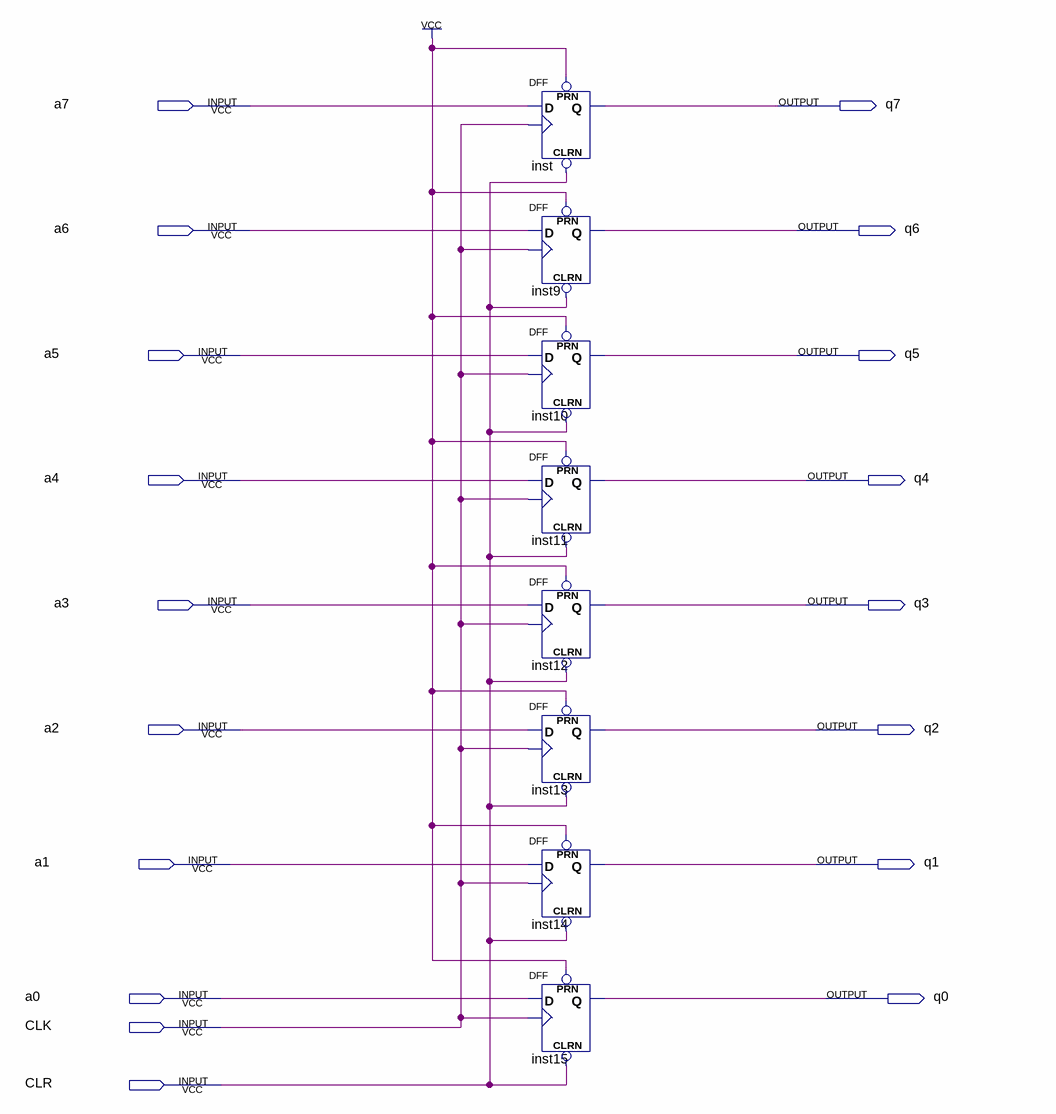
[diagram p0: schematic sheet]
// Quartus schematic REGrs.bdf as structural Verilog: 8 symbols, 18 pins
module REGrs (
  input  a7,
  input  a6,
  input  a5,
  input  a4,
  input  a3,
  input  a2,
  input  a1,
  input  a0,
  input  CLK,
  input  CLR,
  output q7,
  output q6,
  output q5,
  output q4,
  output q3,
  output q2,
  output q1,
  output q0
);

  DFF inst (.CLRN(CLR), .CLK(CLK), .D(a7), .PRN(1'b1), .Q(q7));
  DFF inst9 (.CLRN(CLR), .CLK(CLK), .D(a6), .PRN(1'b1), .Q(q6));
  DFF inst10 (.CLRN(CLR), .CLK(CLK), .D(a5), .PRN(1'b1), .Q(q5));
  DFF inst11 (.CLRN(CLR), .CLK(CLK), .D(a4), .PRN(1'b1), .Q(q4));
  DFF inst12 (.CLRN(CLR), .CLK(CLK), .D(a3), .PRN(1'b1), .Q(q3));
  DFF inst13 (.CLRN(CLR), .CLK(CLK), .D(a2), .PRN(1'b1), .Q(q2));
  DFF inst14 (.CLRN(CLR), .CLK(CLK), .D(a1), .PRN(1'b1), .Q(q1));
  DFF inst15 (.CLRN(CLR), .CLK(CLK), .D(a0), .PRN(1'b1), .Q(q0));
endmodule
